# Altium project UltraZohm_ADC.PrjPCB (part 2 of 2)

## Sheet Power.SchDoc
size A4; Author: Simon Lukas; CompanyName: Technische Hochschule Nürnberg Georg Simon Ohm; Organization: UltraZohm; Address1: Kesslerplatz 12; Address2: 90489 Nürnberg; Address3: GERMANY; DocumentNumber: 2; SheetNumber: 2; SheetTotal: 6; Website: www.ultrazohm.com
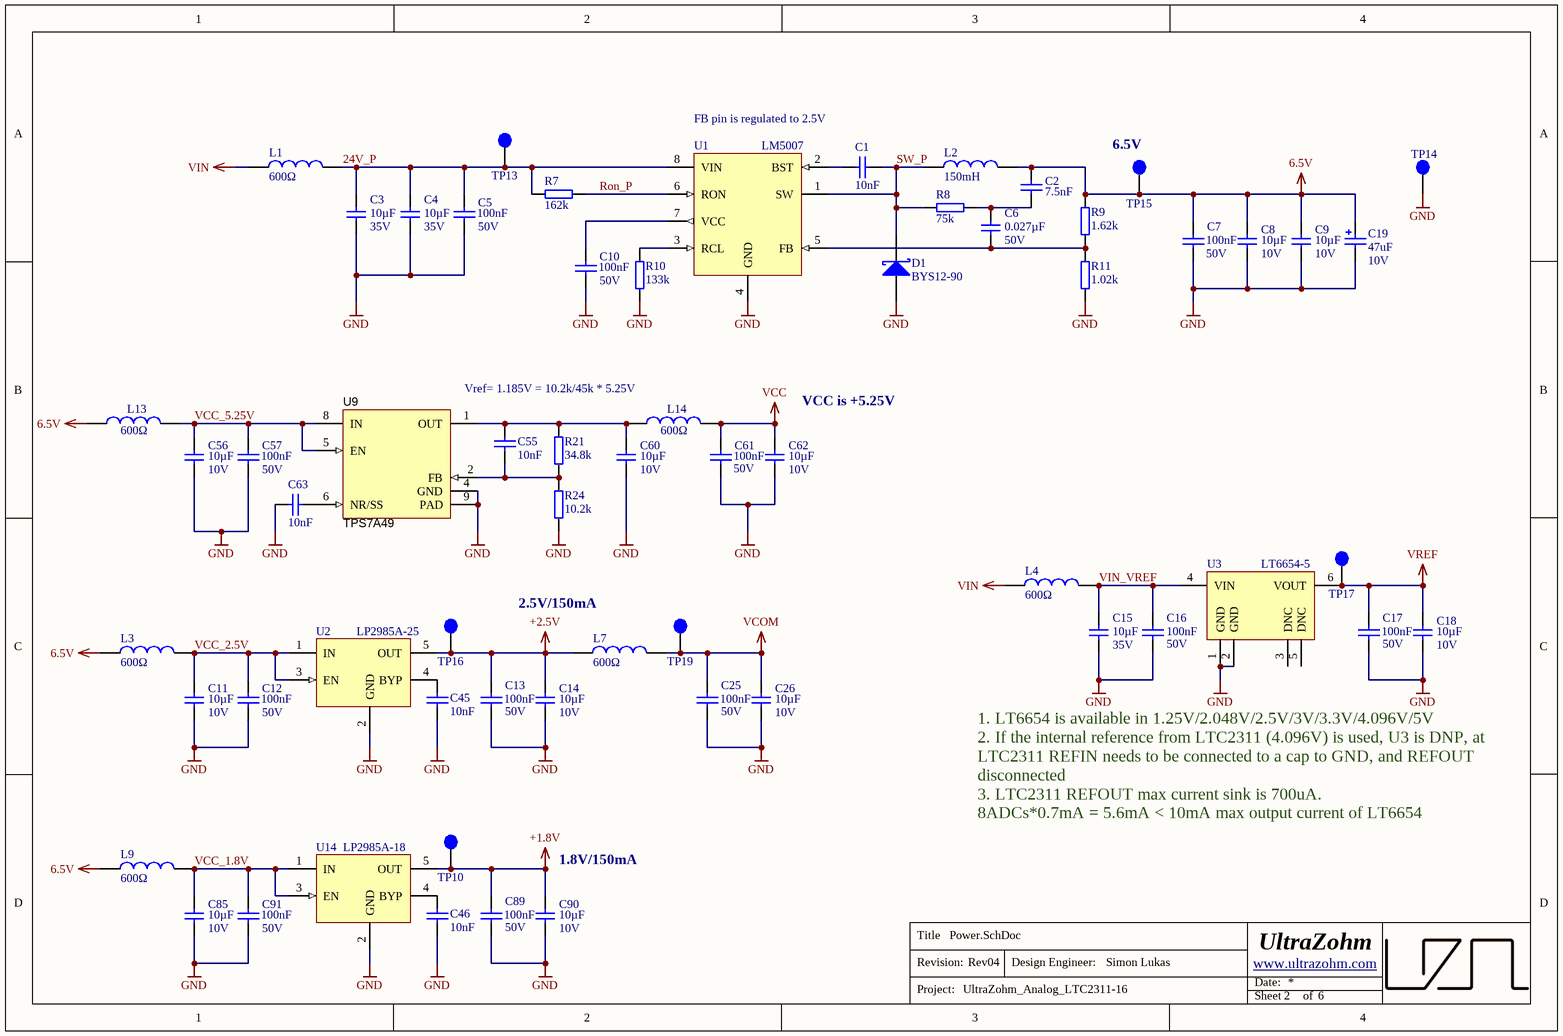
[diagram p6: Power.SchDoc]

### Parts
C1  10nF  [CAPC1608X07N]
C2  7.5nF  [CAPC1608X07N]
C3  10µF  Voltage: 35V  [C_1206]
C4  10µF  Voltage: 35V  [C_1206]
C5  100nF  Voltage: 50V  [CAPC1608X07N]
C6  0.027µF  Voltage: 50V  [C_1206]
C7  100nF  Voltage: 50V  [CAPC1608X07N]
C8  10µF  Voltage: 10V  [C_1206]
C9  10µF  Voltage: 10V  [C_1206]
C10  100nF  Voltage: 50V  [CAPC1608X07N]
C11  10µF  Voltage: 10V  [C_1206]
C12  100nF  Voltage: 50V  [CAPC1608X07N]
C13  100nF  Voltage: 50V  [CAPC1608X07N]
C14  10µF  Voltage: 10V  [C_1206]
C15  10µF  Voltage: 35V  [C_1206]
C16  100nF  Voltage: 50V  [CAPC1608X07N]
C17  100nF  Voltage: 50V  [CAPC1608X07N]
C18  10µF  Voltage: 10V  [C_1206]
C19  47uF  Voltage: 10V  [WCAP-ASLI_5x5.5]
C25  100nF  Voltage: 50V  [CAPC1608X07N]
C26  10µF  Voltage: 10V  [C_1206]
C45  10nF  [CAPC1608X07N]
C46  10nF  [CAPC1608X07N]
C55  10nF  [CAPC1608X07N]
C56  10µF  Voltage: 10V  [C_1206]
C57  100nF  Voltage: 50V  [CAPC1608X07N]
C60  10µF  Voltage: 10V  [C_1206]
C61  100nF  Voltage: 50V  [CAPC1608X07N]
C62  10µF  Voltage: 10V  [C_1206]
C63  10nF  [CAPC1608X07N]
C85  10µF  Voltage: 10V  [C_1206]
C89  100nF  Voltage: 50V  [CAPC1608X07N]
C90  10µF  Voltage: 10V  [C_1206]
C91  100nF  Voltage: 50V  [CAPC1608X07N]
D1  BYS12-90  [DIOM4227X23N]
L1  600Ω  [WE-CBF_0805_High Current]
L2  150mH  [SMT_inductor_1050_Performance]
L3  600Ω  [WE-CBF_0805_High Current]
L4  600Ω  [WE-CBF_0805_High Current]
L7  600Ω  [WE-CBF_0805_High Current]
L9  600Ω  [WE-CBF_0805_High Current]
L13  600Ω  [WE-CBF_0805_High Current]
L14  600Ω  [WE-CBF_0805_High Current]
R7  162k  [RESC1608X06N]
R8  75k  [RESC1608X06N]
R9  1.62k  [RESC1608X06N]
R10  133k  [RESC1608X06N]
R11  1.02k  [RESC1608X06N]
R21  34.8k  [RESC1608X06N]
R24  10.2k  [RESC1608X06N]
TP10  +1.8V  [TP_1mm]  (value not drawn)  (no BOM)
TP13  VIN  [TP_1mm]  (value not drawn)  (no BOM)
TP14  GND  [TP_1mm]  (value not drawn)  (no BOM)
TP15  +5V  [TP_1mm]  (value not drawn)  (no BOM)
TP16  OVCC  [TP_1mm]  (value not drawn)  (no BOM)
TP17  VREF  [TP_1mm]  (value not drawn)  (no BOM)
TP19  VCOM  [TP_1mm]  (value not drawn)  (no BOM)
U1  LM5007  [TSOP65P490X110-8N]
U2  LP2985A-25  [SOT95P250X110-5N]
U3  LT6654-5  [SOT95P280X100-6N]
U9  TPS7A49  [DGN0008D_N]
U14  LP2985A-18  [SOT95P250X110-5N]

### Nets
6.5V: C2.1 C7.2 C8.2 C9.2 C19.2(P) L2.2 L3.1 L9.1 L13.1 R9.2 TP15.1
+1.8V: C89.1 C90.2 TP10.1 U14.5(OUT)
+2.5V: C13.1 C14.2 L7.1 TP16.1 U2.5(OUT)
GND: C3.1 C4.1 C5.2 C7.1 C8.1 C9.1 C10.2 C11.1 C12.2 C13.2 C14.1 C15.1 C16.2 C17.2 C18.1 C19.1(N) C25.2 C26.1 C45.1 C46.1 C56.1 C57.2 C60.1 C61.1 C62.1 C63.2 C85.1 C89.2 C90.1 C91.2 D1.2(A) R10.1 R11.1 R24.2 TP14.1 U1.4(GND) U2.2(GND) U3.1(GND) U3.2(GND) U9.4(GND) U9.9(PAD) U14.2(GND)
VCC: C61.2 C62.2 L14.2
VCOM: C25.1 C26.2 L7.2 TP19.1
VIN: L1.1 L4.1
VREF: C17.1 C18.2 TP17.1 U3.6(VOUT)
24V_P: C3.2 C4.2 C5.1 L1.2 R7.1 TP13.1 U1.8(VIN)
Ron_P: R7.2 U1.6(RON)
SW_P: C1.2 D1.1(K) L2.1 R8.1 U1.1(SW)
VCC_1.8V: C85.2 C91.1 L9.2 U14.1(IN) U14.3(EN)
VCC_2.5V: C11.2 C12.1 L3.2 U2.1(IN) U2.3(EN)
VCC_5.25V: C56.2 C57.1 L13.2 U9.5(EN) U9.8(IN)
VIN_VREF: C15.2 C16.1 L4.2 U3.4(VIN)
NetC1_1: C1.1 U1.2(BST)
NetC2_2: C2.2 C6.2 R8.2
NetC6_1: C6.1 R9.1 R11.2 U1.5(FB)
NetC10_1: C10.1 U1.7(VCC)
NetC45_2: C45.2 U2.4(BYP)
NetC46_2: C46.2 U14.4(BYP)
NetC55_1: C55.1 C60.2 L14.1 R21.1 U9.1(OUT)
NetC55_2: C55.2 R21.2 R24.1 U9.2(FB)
NetC63_1: C63.1 U9.6(NR/SS)
NetR10_2: R10.2 U1.3(RCL)

Not connected (* = marked no-connect by the designer): U3 3(DNC) 5(DNC); U9 3(NC) 7(DNC)

### Notes on the sheet
- FB pin is regulated to 2.5V
- (near TP15) 6.5V
- Vref= 1.185V = 10.2k/45k * 5.25V
- (near C62) VCC is +5.25V
- (near L7) 2.5V/150mA
- 1. LT6654 is available in 1.25V/2.048V/2.5V/3V/3.3V/4.096V/5V
  2. If the internal reference from LTC2311 (4.096V) is used, U3 is DNP, at LTC2311 REFIN needs to be connected to a cap to GND, and REFOUT disconnected
  3. LTC2311 REFOUT max current sink is 700uA.
  8ADCs*0.7mA = 5.6mA < 10mA max output current of LT6654
- (near C90) 1.8V/150mA
- Title
- Revision:
- Design Engineer:
- Date:
- Project:
- Sheet
- of

### Library data of the parts
C1 C45 C46 = Cap_0603: MPN: 885012206065; MF: Würth; Voltage: 25V; Dielectric: X7R; Value: 10nF; Supplier 1: Mouser; Supplier 2: *; Supplier Part Number 1: 710-885012206065; Supplier Part Number 2: *; Package: 0603
C2 = Cap_0603: MPN: C0603C752J3GACTU; MF: KEMET; Voltage: 25V; Dielectric: C0G; Value: 7.5nF; Supplier 1: Mouser; Supplier 2: *; Supplier Part Number 1: 80-C0603C752J3GACTU; Supplier Part Number 2: *; Package: 0603
C3 C4 C15 = C_1206: Capacitor 1206; MPN: 1206DD106MAT2A; Tolerance: 20%; MF: AVX; Dielectric: X5R; Package: 1206; Value: 10µF; Supplier 1: Mouser; Supplier Part Number 1: 581-1206DD106MAT2A
C5 C10 C12 C57 C61 C91 = Cap_0603: MPN: CC0603KRX7R9BB104; MF: Yageo; Tolerance: 10%; Dielectric: X5R; Value: 100nF; Supplier 1: Mouser; Supplier 2: Mouser; Supplier Part Number 1: 603-CC603KRX7R9BB104; Supplier Part Number 2: 710-885382206004; Package: 0603
C6 = C_1206: Capacitor 1206; MPN: GRM3195C1H273JA01D; Tolerance: 5%; MF: Murata; Dielectric: C0G; Package: 1206; Value: 0.027µF; Created: 2018_06_25_AGeiger; Supplier 1: Mouser; Supplier Part Number 1: 81-GRM315C1H273JA01D
C7 C13 C16 C17 C25 C89 = Cap_0603: MPN: CC0603KRX7R9BB104; MF: Yageo; Dielectric: X5R; Value: 100nF; Supplier 1: Mouser; Supplier 2: Mouser; Supplier Part Number 1: 603-CC603KRX7R9BB104; Supplier Part Number 2: 710-885382206004; Package: 0603
C8 C9 C11 C14 C18 C26 C56 C60 C62 C85 C90 = C_1206: Capacitor 1206; MPN: CL31A106KPHNNNE; Tolerance: 10%; MF: Samsung Electro-Mechanics; Dielectric: X5R; Package: 1206; Value: 10µF; Created: 2020_09_17_Liegmann; Supplier 1: Mouser; Supplier Part Number 1: 187-CL31A106KPHNNNE
C19 = 865080142007: WCAP-ASLI Aluminum Electrolytic Capacitor, V-Chip, SMT, D5xH5.5mm, 47uF, 10V; MPN: 865080242004; Dissipation Factor: 24%; Endurance: 2000h; Leakage Current: 6.3uA; MF: Wurth Elektronik; Ripple Current: 170mA; Capacitance Tolerance: +/-20%; Technical Reference: ASEC055101M6R3DVCTBB000; ComponentLink1Description: Manufacturer; ComponentLink1URL: http://www.we-online.de; ComponentLink2Description: Datasheet; ComponentLink2URL: https://www.we-online.com/catalog/datasheet/865080142007.pdf; Height: 5.5mm; Mounting Technology: SMT; Operating Temperature: -55 to +105degC; Packaging: Tape and Reel; Published Date: May 2020; Diameter: 5mm; Supplier 1: Mouser; Supplier Part Number 1: 710-865080242004; Value: 47uF
C55 C63 = Cap_0603: MPN: 885012206065; MF: Würth Elektronik; Voltage: 25V; Dielectric: X7R; Value: 10nF; Supplier 1: Mouser; Supplier 2: Digi-Key; Supplier Part Number 1: 710-885012206065; Supplier Part Number 2: 732-7983-1-ND; Package: 0603
D1 = BYS12-90: Schottky Diode; MPN: BYS12-90-E3/TR3; MF: Vishay; Forward Voltage: 750mV; Reverse Voltage: 90V; Rated Current: 1.5A; Package: DO-214AC; Supplier 1: Farnell; Supplier 2: Mouser; Supplier 3: Digi-Key; Supplier Part Number 1: 2889144; Supplier Part Number 2: 625-BYS12-90-E3/TR3; Supplier Part Number 3: BYS12-90-E3/GICT-ND; ComponentLink1Description: Manufacturer; ComponentLink1URL: https://www.vishay.com/; ComponentLink2Description: Datasheet; ComponentLink2URL: https://www.vishay.com/docs/88950/bys12-90.pdf
L1 L3 L4 L7 L9 = WE-CBF, 742792040: WE-CBF SMD EMI Suppression Ferrite Bead, 0805, 600Ω; MF: Wurth Elektronik; Type: High Current; PublishedDate: Aug 2016; ComponentLink1Description: Manufacturer; ComponentLink1URL: http://www.we-online.de; ComponentLink2Description: Datasheet; ComponentLink2URL: http://katalog.we-online.de/pbs/datasheet/742792040.pdf; MPN: 742792040; Value: 600Ω; Size: 0805; Supplier 1: Farnell; Supplier 2: Mouser; Supplier 3: Digi-Key; Supplier Part Number 1: 2761567; Supplier Part Number 2: 710-742792040; Supplier Part Number 3: 732-1620-1-ND
L2 = B82464G4154M: SMT power Inductor, 150uH, 320m DRC; MF: EPCOS / TDK; Rated Current: 0.85 A; MPN: B82464G4154M; Supplier 1: Mouser; Supplier Part Number 1: 871-B82464G4154M; Value: 150mH; DCR: 320m; ComponentLink1Description: Manufacturer; ComponentLink1URL: https://www.tdk-electronics.tdk.com/de; ComponentLink2Description: Datasheet; ComponentLink2URL: https://www.tdk-electronics.tdk.com/inf/30/db/ind_2008/b82464g4.pdf
L13 L14 = WE-CBF, 742792040: WE-CBF SMD EMI Suppression Ferrite Bead, 0805, 600Ω; MF: Würth Elektronik; Type: High Current; ComponentLink1Description: Manufacturer; ComponentLink1URL: http://www.we-online.de; ComponentLink2Description: Datasheet; ComponentLink2URL: http://katalog.we-online.de/pbs/datasheet/742792040.pdf; MPN: 742792040; Value: 600Ω; Size: 0805; Supplier 1: Farnell; Supplier 2: Mouser; Supplier 3: Digi-Key; Supplier Part Number 1: 1635735; Supplier Part Number 2: 710-742792040; Supplier Part Number 3: 732-1620-1-ND
R7 = R_0603: MPN: CR0603-FX-1623ELF; MF: Bourns; Value: 162k; Supplier 1: Mouser; Supplier Part Number 1: 652-CR0603-FX1623ELF; Package: 0603
R8 = R_0603: MPN: AC0603FR-1375KL; MF: Yageo; Value: 75k; Supplier 1: Mouser; Supplier Part Number 1: 603-AC0603FR-1375KL; Package: 0603
R9 = R_0603: MPN: CR0603-FX-1621ELF; MF: Bourns; Tolerance: 1%; Value: 1.62k; Supplier 1: Mouser; Supplier Part Number 1: 652-CR0603FX-1621ELF; Package: 0603
R10 = R_0603: MPN: CR0603-FX-1333ELF; MF: Bourns; Value: 133k; Supplier 1: Mouser; Supplier Part Number 1: 652-CR0603FX-1333ELF; Package: 0603
R11 = R_0603: MPN: CR0603-FX-1021ELF; MF: Bourns; Tolerance: 1%; Value: 1.02k; Supplier 1: Mouser; Supplier Part Number 1: 652-CR0603FX-1021ELF; Package: 0603
R21 = R_0603: MPN: CR0603-FX-3482ELF; MF: Bourns; Tolerance: 1%; Value: 34.8k; Supplier 1: Mouser; Supplier Part Number 1: 652-CR0603FX-3482ELF; Package: 0603
R24 = R_0603: MPN: CR0603-FX-1022ELF; MF: Bourns; Tolerance: 1%; Value: 10.2k; Supplier 1: Mouser; Supplier Part Number 1: 652-CR0603FX-1022ELF; Package: 0603
TP10 TP13-TP17 TP19 = TP_1mm: Testpoint 1mm; Created: 2018_06_25_AGeiger; Value: Testpoint 1mm
U1 = LM5007: Buck Converter, 9-75Vin, 2.5-73Vout; MPN: LM5007MM/NOPB; MF: Texas Instruments; Supplier 1: Farnell; Supplier 2: Mouser; Supplier 3: Digi-Key; Supplier Part Number 1: 9779345; Supplier Part Number 2: 926-LM5007MM/NOPB; Supplier Part Number 3: LM5007MM/NOPBCT-ND; Package: VSSOP-8; ComponentLink1Description: Manufacturer; ComponentLink1URL: https://www.ti.com/; ComponentLink2Description: Datasheet; ComponentLink2URL: https://www.ti.com/lit/ds/symlink/lm5007.pdf?ts=1616234834930&ref_url=https%253A%252F%252Fwww.google.ru%252F
U2 = LP2985A-25: 150mA, LDO, Vout = 2.5V, Vin,max = 16V; MF: Texas Instruments; MPN: LP2985A-25; Supplier 1: Mouser; Supplier Part Number 1: 595-LP2985A-25DBVR; Package: SOT-23-5; ComponentLink1Description: Manufacturer; ComponentLink1URL: https://www.ti.com/; ComponentLink2Description: Datasheet; ComponentLink2URL: https://www.ti.com/lit/ds/symlink/lp2985a.pdf
U3 = LT6654: MPN: LT6654AIS6-5#TRMPBF; MF: Analog Devices; Package: TSOT-23-6; Supplier 1: Farnell; Supplier 2: Mouser; Supplier 3: Digi-Key; Supplier Part Number 1: 2761960; Supplier Part Number 2: 584-6654AIS65TRMPBF; Supplier Part Number 3: LT6654AIS6-5#TRMPBFCT-ND; ComponentLink1Description: Manufacturer; ComponentLink1URL: https://www.analog.com/en/index.html; ComponentLink2Description: Datasheet; ComponentLink2URL: https://www.analog.com/media/en/technical-documentation/data-sheets/6654fh.pdf
U9 = TPS7A4901DGN: +36V, +150mA, Ultralow-Noise, Positive LINEAR REGULATOR, DGN0008D; CompType: IC; MF: Texas Instruments; MPN: TPS7A4901DGN; PackageReference: DGN0008D; MountType: SMT; ComponentLink1Description: Datasheet Link; ComponentLink1URL: http://www.ti.com/lit/ds/symlink/tps7a4901.pdf; Supplier 1: Digi-Key; Supplier Part Number 1: 296-27751-6-ND; Supplier 2: Mouser; Supplier Part Number 2: 595-TPS7A4901DGNR; Supplier 3: Fanell; Supplier Part Number 3: 3008004
U14 = LP2985A-18: 150mA, LDO, Vout = 1.8V , Vin,max = 16V; Manufacturer 1: Texas Instruments; Supplier 1: Mouser; Supplier Part Number 1: 595-LP2985A-18DBVJ; Package: SOT-23-5; ComponentLink1Description: Manufacturer; ComponentLink1URL: https://www.ti.com/; ComponentLink2Description: Datasheet; ComponentLink2URL: https://www.ti.com/lit/ds/symlink/lp2985a.pdf; Manufacturer Part Number 1: LP2985A-18

## Nets that join several sheets
+1.8V: CarrierConnector (10 pins), Power (C89.1 C90.2 TP10.1 U14.5)
+2.5V: AnalogConnector (R28.2), ADC1 (C29A.1 U6A.10 U6A.12), ADC2 (C29B.1 U6B.10 U6B.12), ADC3 (C29C.1 U6C.10 U6C.12), ADC4 (C29D.1 U6D.10 U6D.12), ADC5 (C29E.1 U6E.10 U6E.12), ADC6 (C29F.1 U6F.10 U6F.12), ADC7 (C29G.1 U6G.10 U6G.12), ADC8 (C29H.1 U6H.10 U6H.12), Power (5 pins)
GND: CarrierConnector (42 pins), AnalogConnector (20 pins), ADC1 (13 pins), ADC2 (13 pins), ADC3 (13 pins), ADC4 (13 pins), ADC5 (13 pins), ADC6 (13 pins), ADC7 (13 pins), ADC8 (13 pins), OpAmp1 (11 pins), OpAmp2 (11 pins), OpAmp3 (11 pins), OpAmp4 (11 pins), OpAmp5 (11 pins), OpAmp6 (11 pins), OpAmp7 (11 pins), OpAmp8 (11 pins), Power_Neg (22 pins), Power (42 pins)
negRail: OpAmp1 (C44A.2 U15A.6), OpAmp2 (C44B.2 U15B.6), OpAmp3 (C44C.2 U15C.6), OpAmp4 (C44D.2 U15D.6), OpAmp5 (C44E.2 U15E.6), OpAmp6 (C44F.2 U15F.6), OpAmp7 (C44G.2 U15G.6), OpAmp8 (C44H.2 U15H.6), Power_Neg (L8.2 L15.2 L17.2 TP9.1)
VCC+: CarrierConnector (R4.1), AnalogConnector (R56.2), ADC1 (C27A.1 C28A.1 U6A.4), ADC2 (C27B.1 C28B.1 U6B.4), ADC3 (C27C.1 C28C.1 U6C.4), ADC4 (C27D.1 C28D.1 U6D.4), ADC5 (C27E.1 C28E.1 U6E.4), ADC6 (C27F.1 C28F.1 U6F.4), ADC7 (C27G.1 C28G.1 U6G.4), ADC8 (C27H.1 C28H.1 U6H.4), OpAmp1 (C39A.1 C40A.1 U7A.8 U15A.3), OpAmp2 (C39B.1 C40B.1 U7B.8 U15B.3), OpAmp3 (C39C.1 C40C.1 U7C.8 U15C.3), OpAmp4 (C39D.1 C40D.1 U7D.8 U15D.3), OpAmp5 (C39E.1 C40E.1 U7E.8 U15E.3), OpAmp6 (C39F.1 C40F.1 U7F.8 U15F.3), OpAmp7 (C39G.1 C40G.1 U7G.8 U15G.3), OpAmp8 (C39H.1 C40H.1 U7H.8 U15H.3), Power_Neg (C78.2 R25.2 U11.7)
VCC-: AnalogConnector (R73.1), OpAmp1 (C42A.2 U7A.4), OpAmp2 (C42B.2 U7B.4), OpAmp3 (C42C.2 U7C.4), OpAmp4 (C42D.2 U7D.4), OpAmp5 (C42E.2 U7E.4), OpAmp6 (C42F.2 U7F.4), OpAmp7 (C42G.2 U7G.4), OpAmp8 (C42H.2 U7H.4), Power_Neg (10 pins)
VCOM: OpAmp1 (C36A.1 U15A.2), OpAmp2 (C36B.1 U15B.2), OpAmp3 (C36C.1 U15C.2), OpAmp4 (C36D.1 U15D.2), OpAmp5 (C36E.1 U15E.2), OpAmp6 (C36F.1 U15F.2), OpAmp7 (C36G.1 U15G.2), OpAmp8 (C36H.1 U15H.2), Power (C25.1 C26.2 L7.2 TP19.1)
VIN: CarrierConnector (X1.5 X1.6), AnalogConnector (5 pins), Power_Neg (L5.1), Power (L1.1 L4.1)
VREF: ADC1 (R43A.2), ADC2 (R43B.2), ADC3 (R43C.2), ADC4 (R43D.2), ADC5 (R43E.2), ADC6 (R43F.2), ADC7 (R43G.2), ADC8 (R43H.2), Power (C17.1 C18.2 TP17.1 U3.6)
ADC_OUT_N1: CarrierConnector (X1.43), ADC1 (U6A.13)
ADC_OUT_N2: CarrierConnector (X1.37), ADC2 (U6B.13)
ADC_OUT_N3: CarrierConnector (X1.31), ADC3 (U6C.13)
ADC_OUT_N4: CarrierConnector (X1.25), ADC4 (U6D.13)
ADC_OUT_N5: CarrierConnector (X1.44), ADC5 (U6E.13)
ADC_OUT_N6: CarrierConnector (X1.38), ADC6 (U6F.13)
ADC_OUT_N7: CarrierConnector (X1.32), ADC7 (U6G.13)
ADC_OUT_N8: CarrierConnector (X1.26), ADC8 (U6H.13)
ADC_OUT_P1: CarrierConnector (X1.41), ADC1 (U6A.14)
ADC_OUT_P2: CarrierConnector (X1.35), ADC2 (U6B.14)
ADC_OUT_P3: CarrierConnector (X1.29), ADC3 (U6C.14)
ADC_OUT_P4: CarrierConnector (X1.23), ADC4 (U6D.14)
ADC_OUT_P5: CarrierConnector (X1.42), ADC5 (U6E.14)
ADC_OUT_P6: CarrierConnector (X1.36), ADC6 (U6F.14)
ADC_OUT_P7: CarrierConnector (X1.30), ADC7 (U6G.14)
ADC_OUT_P8: CarrierConnector (X1.24), ADC8 (U6H.14)
AIN_N1: AnalogConnector (J1.A8), OpAmp1 (R66A.1)
AIN_N2: AnalogConnector (J1.A5), OpAmp2 (R66B.1)
AIN_N3: AnalogConnector (J1.A6), OpAmp3 (R66C.1)
AIN_N4: AnalogConnector (J1.A2), OpAmp4 (R66D.1)
AIN_N5: AnalogConnector (J1.B8), OpAmp5 (R66E.1)
AIN_N6: AnalogConnector (J1.B5), OpAmp6 (R66F.1)
AIN_N7: AnalogConnector (J1.B6), OpAmp7 (R66G.1)
AIN_N8: AnalogConnector (J1.B2), OpAmp8 (R66H.1)
AIN_P1: AnalogConnector (J1.A7), OpAmp1 (R65A.1)
AIN_P2: AnalogConnector (J1.A4), OpAmp2 (R65B.1)
AIN_P3: AnalogConnector (J1.A3), OpAmp3 (R65C.1)
AIN_P4: AnalogConnector (J1.A1), OpAmp4 (R65D.1)
AIN_P5: AnalogConnector (J1.B7), OpAmp5 (R65E.1)
AIN_P6: AnalogConnector (J1.B4), OpAmp6 (R65F.1)
AIN_P7: AnalogConnector (J1.B3), OpAmp7 (R65G.1)
AIN_P8: AnalogConnector (J1.B1), OpAmp8 (R65H.1)
CLK_N: CarrierConnector (R1.1 R2.1 TP1.1 X1.19), ADC1 (U6A.15), ADC2 (U6B.15), ADC3 (U6C.15), ADC4 (U6D.15), ADC5 (U6E.15), ADC6 (U6F.15), ADC7 (U6G.15), ADC8 (U6H.15)
CLK_P: CarrierConnector (R1.2 R2.2 TP2.1 X1.17), ADC1 (U6A.16), ADC2 (U6B.16), ADC3 (U6C.16), ADC4 (U6D.16), ADC5 (U6E.16), ADC6 (U6F.16), ADC7 (U6G.16), ADC8 (U6H.16)
CVN1: CarrierConnector (R33.2 R48.2), ADC1 (U6A.9)
CVN2: CarrierConnector (R37.2 R53.2), ADC2 (U6B.9)
CVN3: CarrierConnector (R40.2 R57.2), ADC3 (U6C.9)
CVN4: CarrierConnector (R42.2 R60.2), ADC4 (U6D.9)
CVN5: CarrierConnector (R61.2), ADC5 (U6E.9)
CVN6: CarrierConnector (R63.2), ADC6 (U6F.9)
CVN7: CarrierConnector (R62.2), ADC7 (U6G.9)
CVN8: CarrierConnector (R64.2), ADC8 (U6H.9)
OUT_N1: ADC1 (R13A.1), OpAmp1 (C34A.2 R17A.2 U15A.5)
OUT_N2: ADC2 (R13B.1), OpAmp2 (C34B.2 R17B.2 U15B.5)
OUT_N3: ADC3 (R13C.1), OpAmp3 (C34C.2 R17C.2 U15C.5)
OUT_N4: ADC4 (R13D.1), OpAmp4 (C34D.2 R17D.2 U15D.5)
OUT_N5: ADC5 (R13E.1), OpAmp5 (C34E.2 R17E.2 U15E.5)
OUT_N6: ADC6 (R13F.1), OpAmp6 (C34F.2 R17F.2 U15F.5)
OUT_N7: ADC7 (R13G.1), OpAmp7 (C34G.2 R17G.2 U15G.5)
OUT_N8: ADC8 (R13H.1), OpAmp8 (C34H.2 R17H.2 U15H.5)
OUT_P1: ADC1 (R12A.1), OpAmp1 (C38A.2 R29A.2 U15A.4)
OUT_P2: ADC2 (R12B.1), OpAmp2 (C38B.2 R29B.2 U15B.4)
OUT_P3: ADC3 (R12C.1), OpAmp3 (C38C.2 R29C.2 U15C.4)
OUT_P4: ADC4 (R12D.1), OpAmp4 (C38D.2 R29D.2 U15D.4)
OUT_P5: ADC5 (R12E.1), OpAmp5 (C38E.2 R29E.2 U15E.4)
OUT_P6: ADC6 (R12F.1), OpAmp6 (C38F.2 R29F.2 U15F.4)
OUT_P7: ADC7 (R12G.1), OpAmp7 (C38G.2 R29G.2 U15G.4)
OUT_P8: ADC8 (R12H.1), OpAmp8 (C38H.2 R29H.2 U15H.4)

## Assembly variants
No Buffer: not fitted C47A C47B C47C C47D C47E C47F C47G C47H C59 C72 D8 R3 R4 R6 R22A R22B R26A R26B R26C R26D R26E R26F R26G R26H R27A R27B R27C R27D R27E R27F R27G R27H R39 U7A U7B
Current Signal: not fitted C47A C47B C47C C47D C47E C47F C47G C47H C59 C72 D8 R3 R4 R6 R15A R15B R16A R16B R39
Buffer Single Clock Pair: not fitted C47A C47B C47C C47D C47E C47F C47G C47H C59 C72 D8 R3 R4 R6 R15A R15B R16A R16B R22A R22B R26A R26B R26C R26D R26E R26F R26G R26H R27A R27B R27C R27D R27E R27F R27G R27H R39